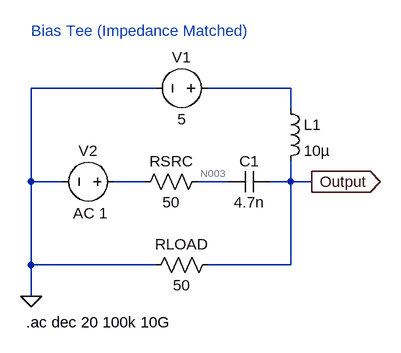
[diagram p0: schematic Bias-Tee_v2_AC_matched.asc]
Bias-Tee_v2_AC_matched.asc, the LTspice schematic file:
Version 4
SHEET 1 880 680
WIRE 96 0 -96 0
WIRE 304 0 176 0
WIRE 304 32 304 0
WIRE -96 144 -96 0
WIRE -48 144 -96 144
WIRE 80 144 32 144
WIRE 208 144 160 144
WIRE 304 144 304 112
WIRE 304 144 272 144
WIRE 336 144 304 144
WIRE -96 272 -96 144
WIRE 96 272 -96 272
WIRE 304 272 304 144
WIRE 304 272 176 272
WIRE -96 320 -96 272
FLAG 336 144 Output
IOPIN 336 144 Out
FLAG -96 320 0
SYMBOL voltage 192 0 R90
WINDOW 0 -32 56 VBottom 2
WINDOW 3 32 56 VTop 2
WINDOW 123 0 0 Left 0
WINDOW 39 0 0 Left 0
SYMATTR InstName V1
SYMATTR Value 5
SYMBOL voltage 48 144 R90
WINDOW 0 -32 56 VBottom 2
WINDOW 3 32 56 VTop 2
WINDOW 123 33 53 VTop 2
WINDOW 39 0 0 Left 0
SYMATTR InstName V2
SYMATTR Value ""
SYMATTR Value2 AC 1
SYMBOL ind 288 16 R0
SYMATTR InstName L1
SYMATTR Value 10µ
SYMBOL res 176 128 R90
WINDOW 0 0 56 VBottom 2
WINDOW 3 32 56 VTop 2
SYMATTR InstName RSRC
SYMATTR Value 50
SYMBOL cap 272 128 R90
WINDOW 0 0 32 VBottom 2
WINDOW 3 32 32 VTop 2
SYMATTR InstName C1
SYMATTR Value 4.7n
SYMBOL res 192 256 R90
WINDOW 0 0 56 VBottom 2
WINDOW 3 32 56 VTop 2
SYMATTR InstName RLOAD
SYMATTR Value 50
TEXT -96 -88 Left 2 ;Bias Tee (Impedance Matched)
TEXT -104 360 Left 2 !.ac dec 20 100k 10G

The netlist it stands for:
* Bias-Tee_v2_AC_matched.asc
V1 N001 0 5
V2 N002 0 AC 1
L1 N001 Output 10µ
RSRC N003 N002 50
C1 Output N003 4.7n
RLOAD Output 0 50
* Bias Tee (Impedance Matched)
.ac dec 20 100k 10G
.backanno
.end

* Results of the author's LTspice run, read from the files saved beside the schematic
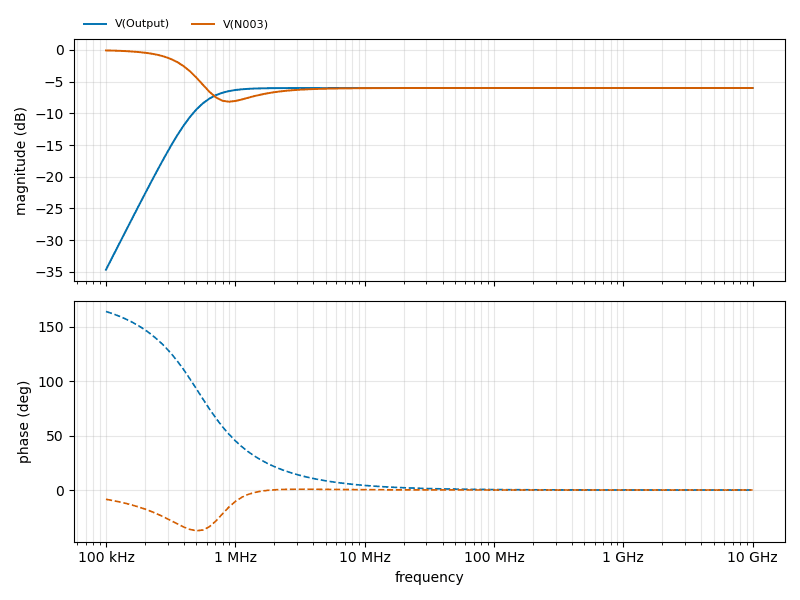
[diagram p1: AC Analysis of Bias-Tee_v2_AC_matched.asc, plotted from the saved traces]
* AC Analysis, 1 run:
*   V(Output): -34.64 dB at 100 kHz, -6.02 dB at 10 GHz, peak -6.02 dB at 10 GHz, 3 dB below the peak at 522.4 kHz
*   V(N003): -0.10 dB at 100 kHz, -6.02 dB at 10 GHz, peak -0.10 dB at 100 kHz, 3 dB below the peak at 429 kHz